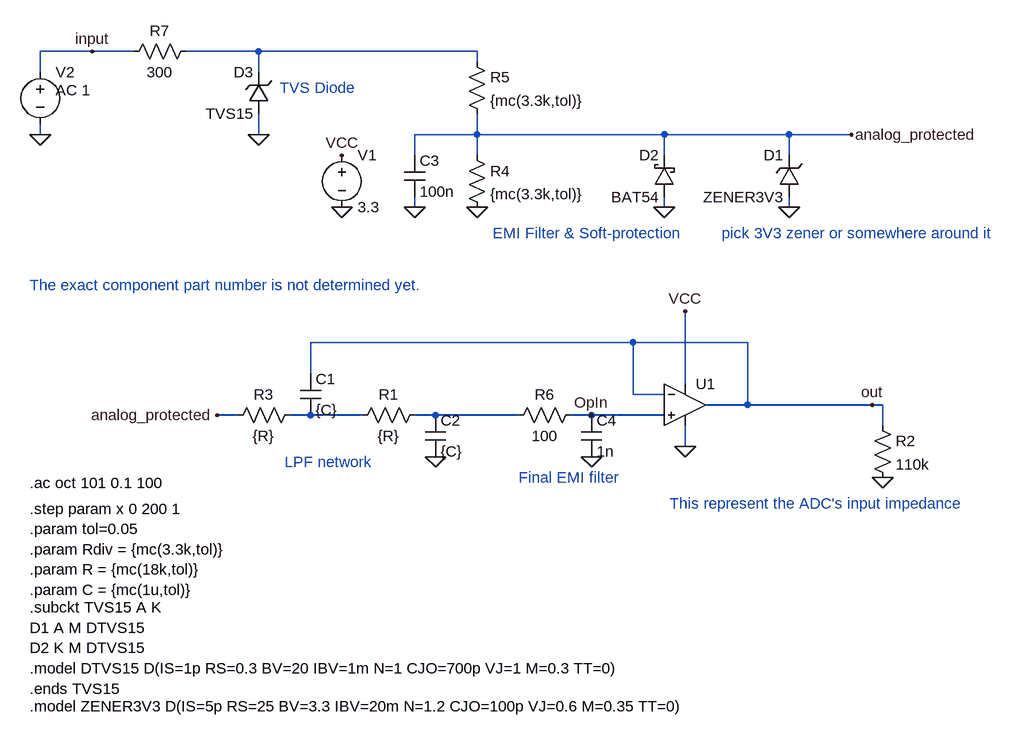
[diagram p0: schematic Anti-Alias Filter - MC.asc]
Anti-Alias Filter - MC.asc, the LTspice schematic file:
Version 4.1
SHEET 1 1140 912
WIRE -608 -240 -688 -240
WIRE -544 -240 -608 -240
WIRE -352 -240 -464 -240
WIRE -16 -240 -352 -240
WIRE -16 -224 -16 -240
WIRE -688 -208 -688 -240
WIRE -352 -208 -352 -240
WIRE -688 -112 -688 -128
WIRE -352 -112 -352 -144
WIRE -16 -112 -16 -144
WIRE -16 -112 -112 -112
WIRE 272 -112 -16 -112
WIRE 464 -112 272 -112
WIRE 560 -112 464 -112
WIRE -112 -80 -112 -112
WIRE -16 -80 -16 -112
WIRE 272 -80 272 -112
WIRE 464 -80 464 -112
WIRE -112 0 -112 -16
WIRE 272 0 272 -16
WIRE 464 0 464 -16
WIRE 224 208 -272 208
WIRE 400 208 224 208
WIRE -272 256 -272 208
WIRE 304 272 304 160
WIRE 224 288 224 208
WIRE 272 288 224 288
WIRE 400 304 400 208
WIRE 400 304 336 304
WIRE 592 304 400 304
WIRE 608 304 592 304
WIRE -384 320 -416 320
WIRE -272 320 -304 320
WIRE -192 320 -272 320
WIRE -80 320 -112 320
WIRE 48 320 -80 320
WIRE 160 320 128 320
WIRE 272 320 160 320
WIRE 608 336 608 304
WIRE 304 368 304 336
FLAG -80 384 0
FLAG 608 416 0
FLAG 304 368 0
FLAG -224 0 0
FLAG -688 -112 0
FLAG -16 0 0
FLAG 304 160 VCC
FLAG -224 -80 VCC
FLAG -112 0 0
FLAG 464 0 0
FLAG 160 384 0
FLAG -352 -112 0
FLAG 560 -112 analog_protected
FLAG -416 320 analog_protected
FLAG 272 0 0
FLAG 592 304 out
FLAG -608 -240 input
FLAG 160 320 OpIn
SYMBOL OpAmps\\UniversalOpAmp 304 304 R0
SYMATTR InstName U1
SYMBOL res -96 304 R90
WINDOW 0 0 56 VBottom 2
WINDOW 3 32 56 VTop 2
SYMATTR InstName R1
SYMATTR Value {R}
SYMBOL res -288 304 R90
WINDOW 0 0 56 VBottom 2
WINDOW 3 32 56 VTop 2
SYMATTR InstName R3
SYMATTR Value {R}
SYMBOL cap -288 256 R0
SYMATTR InstName C1
SYMATTR Value {C}
SYMBOL cap -96 320 R0
SYMATTR InstName C2
SYMATTR Value {C}
SYMBOL res 592 320 R0
SYMATTR InstName R2
SYMATTR Value 110k
SYMBOL voltage -224 -96 R0
WINDOW 123 0 0 Left 0
WINDOW 39 0 0 Left 0
SYMATTR InstName V1
SYMATTR Value 3.3
SYMBOL res -32 -96 R0
SYMATTR InstName R4
SYMATTR Value {mc(3.3k,tol)}
SYMBOL res -32 -240 R0
SYMATTR InstName R5
SYMATTR Value {mc(3.3k,tol)}
SYMBOL cap -128 -80 R0
SYMATTR InstName C3
SYMATTR Value 100n
SYMBOL cap 144 320 R0
SYMATTR InstName C4
SYMATTR Value 1n
SYMBOL res 144 304 R90
WINDOW 0 0 56 VBottom 2
WINDOW 3 32 56 VTop 2
SYMATTR InstName R6
SYMATTR Value 100
SYMBOL TVSdiode -336 -144 R180
WINDOW 0 24 64 Left 2
WINDOW 3 24 0 Left 2
SYMATTR InstName D3
SYMATTR Value TVS15
SYMATTR Description Diode
SYMATTR Type diode
SYMATTR Prefix X
SYMBOL zener 480 -16 R180
WINDOW 0 24 64 Left 2
WINDOW 3 24 0 Left 2
SYMATTR InstName D1
SYMATTR Value ZENER3V3
SYMATTR Description Diode
SYMATTR Type diode
SYMBOL schottky 288 -16 R180
WINDOW 0 24 64 Left 2
WINDOW 3 24 0 Left 2
SYMATTR InstName D2
SYMATTR Value BAT54
SYMATTR Description Diode
SYMATTR Type diode
SYMBOL res -448 -256 R90
WINDOW 0 0 56 VBottom 2
WINDOW 3 32 56 VTop 2
SYMATTR InstName R7
SYMATTR Value 300
SYMBOL voltage -688 -224 R0
WINDOW 123 24 44 Left 2
WINDOW 39 0 0 Left 0
SYMATTR Value2 AC 1
SYMATTR InstName V2
SYMATTR Value ""
TEXT -320 -184 Left 2 ;TVS Diode
TEXT 8 40 Left 2 ;EMI Filter & Soft-protection
TEXT -312 392 Left 2 ;LPF network
TEXT 48 416 Left 2 ;Final EMI filter
TEXT 360 40 Left 2 ;pick 3V3 zener or somewhere around it
TEXT -704 120 Left 2 ;The exact component part number is not determined yet.
TEXT 280 456 Left 2 ;This represent the ADC's input impedance
TEXT -704 616 Left 2 !.subckt TVS15 A K\nD1 A M DTVS15\nD2 K M DTVS15\n.model DTVS15 D(IS=1p RS=0.3 BV=20 IBV=1m N=1 CJO=700p VJ=1 M=0.3 TT=0)\n.ends TVS15
TEXT -704 768 Left 2 !.model ZENER3V3 D(IS=5p RS=25 BV=3.3 IBV=20m N=1.2 CJO=100p VJ=0.6 M=0.35 TT=0)
TEXT -704 424 Left 2 !.ac oct 101 0.1 100
TEXT -704 464 Left 2 !.step param x 0 200 1\n.param tol=0.05\n.param Rdiv = {mc(3.3k,tol)}\n.param R = {mc(18k,tol)}\n.param C = {mc(1u,tol)}

The netlist it stands for:
* Anti-Alias Filter - MC.asc
X§U1 OpIn out VCC 0 out level1 Avol=1Meg GBW=10Meg Vos=0 En=0 Enk=0 In=0 Ink=0 Rin=500Meg  ; pins In+ In- V+ V- OUT
R1 N003 N002 {R}
R3 N002 analog_protected {R}
C1 out N002 {C}
C2 N003 0 {C}
R2 out 0 110k
V1 VCC 0 3.3
R4 analog_protected 0 {mc(3.3k,tol)}
R5 N001 analog_protected {mc(3.3k,tol)}
C3 analog_protected 0 100n
C4 OpIn 0 1n
R6 OpIn N003 100
X§D3 0 N001 TVS15  ; pins + -
D1 0 analog_protected ZENER3V3
D2 0 analog_protected BAT54
R7 N001 input 300
V2 input 0 AC 1
.model D D
.lib standard.dio
* TVS Diode
* EMI Filter & Soft-protection
* LPF network
* Final EMI filter
* pick 3V3 zener or somewhere around it
* The exact component part number is not determined yet.
* This represent the ADC's input impedance
.subckt TVS15 A K
D1 A M DTVS15
D2 K M DTVS15
.model DTVS15 D(IS=1p RS=0.3 BV=20 IBV=1m N=1 CJO=700p VJ=1 M=0.3 TT=0)
.ends TVS15
.model ZENER3V3 D(IS=5p RS=25 BV=3.3 IBV=20m N=1.2 CJO=100p VJ=0.6 M=0.35 TT=0)
.ac oct 101 0.1 100
.step param x 0 200 1
.param tol=0.05
.param Rdiv = {mc(3.3k,tol)}
.param R = {mc(18k,tol)}
.param C = {mc(1u,tol)}
.lib UniversalOpAmp1.lib
.backanno
.end